# Altium project Blue Tractor_v1.1-2021.PrjPCB (part 3 of 4)

## Sheet [04] - USB-UART.SchDoc
size A4
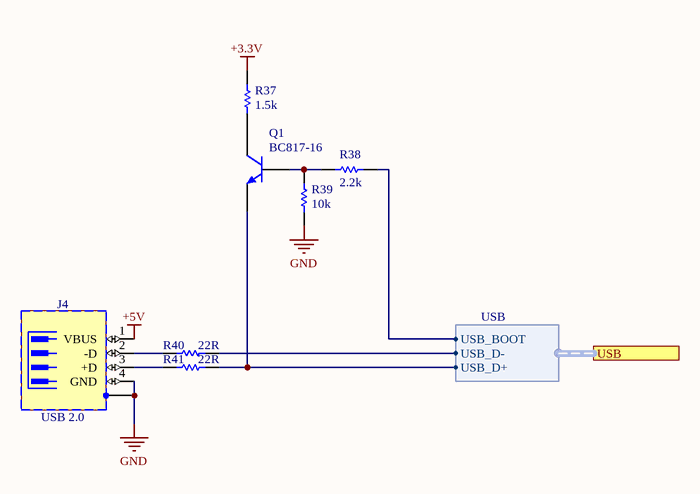
[diagram p5: [04] - USB-UART.SchDoc]

### Parts
J4  USB 2.0  [WURTH_614 104 150 121]
Q1  BC817-16  [SOT23-3]
R37  Resistance: 1.5k  [Res-0603]  (hidden comment: Res1)
R38  Resistance: 2.2k  [Res-0603]  (hidden comment: Res1)
R39  Resistance: 10k  [Res-0603]  (hidden comment: Res1)
R40  Resistance: 22R  [Res-0603]  (hidden comment: Res1)
R41  Resistance: 22R  [Res-0603]  (hidden comment: Res1)

### Ports
USB (harness USB)

### Harnesses
USB: USB_BOOT, USB_D-, USB_D+

### Nets
+3.3V: R37.1
+5V: J4.1(VBUS)
GND: J4.4(GND) J4.5(SHIELD) R39.1
USB_BOOT: R38.2 ; port USB.USB_BOOT
USB_D+: Q1.2(E) R41.1 ; port USB.USB_D+
USB_D–: R40.1 ; port USB.USB_D-
NetJ4_2: J4.2(-D) R40.2
NetJ4_3: J4.3(+D) R41.2
NetQ1_1: Q1.1(B) R38.1 R39.2
NetQ1_3: Q1.3(C) R37.2

### Notes on the sheet
- Title
- Size:
- Date:
- A4
- Number:
- Time:
- Revision:
- Sheet
- of
- File:

### Library data of the parts
J4 = WURTH_614 104 150 121: 4 Pin + 1 Shield USB Receptacle; Part Description: USB 2.0 Type A Receptacle, Right Angle, SLIM Type, 4 Contacts; Manufacturer: WURTH ELEKTRONIK; PressFit: No; Number of Contacts: 4; Part Number: WURTH_614 104 150 121; Component Kind: Standard; Component Type: Standard; Pin Count: 5; Family: USB 2.0; Mounted: Yes; Socket: No; SMD: No; Sense: No; Status: None; Manufacturer Part Number: 614 104 150 121; ComponentHeight: 7.2mm; HelpURL: \\cern.ch\dfs\Applications\Altium\Datasheets\WURTH_614 104 150 121.pdf; Author: CERN DEM JMW; CreateDate: 07.07.2015; LatestRevisionDate: 07.07.2015; Supplier 1: Digi-Key; Supplier Part Number 1: 732-5962-6-ND; Stock 1: 1074; Pricing 1: 1=2.1, 10=1.927, 50=1.784, 100=1.641 (USD); Mount: Through Hole,Horizontal; Contact Material: Copper Alloy; Contact Plating: Gold; Packaging: Tape and Reel; Connector Type: USB; Gender: Receptacle; Orientation: Right Angle; USB Standard: USB 2.0; REACH SVHC: Unknown; ComponentLink1URL: https://www.distrelec.biz/Web/Downloads/40/28/614104150121.pdf?mime=application%2Fpdf; ComponentLink1Description: https://www.distrelec.biz/Web/Downloads/40/28/614104150121.pdf?mime=application%2Fpdf; ComponentLink2URL: http://katalog.we-online.de/em/datasheet/614104150121.pdf; ComponentLink2Description: http://katalog.we-online.de/em/datasheet/614104150121.pdf; ComponentLink3URL: http://www.farnell.com/cad/2130935.pdf; ComponentLink3Description: http://www.farnell.com/cad/2130935.pdf; ComponentLink4URL: http://www.farnell.com/cad/1889803.pdf; ComponentLink4Description: http://www.farnell.com/cad/1889803.pdf
Q1 = BC817-16: NPN General-purpose Transistor; Manufacturer: ON Semiconductor; Manufacturer Part Number: BC817-16LT3G; hFE Min: 100; Max Power Dissipation: 300mW; Collector Emitter Voltage (VCEO): 45V; Max Collector Current: 500mA; Transition Frequency: 100MHz; Collector Base Voltage (VCBO): 50V; Emitter Base Voltage (VEBO): 5V; Collector Emitter Saturation Voltage: 700mV; Element Configuration: Single; Number of Elements: 1; ComponentLink1URL: http://www.mccsemi.com/up_pdf/BC817-16~BC817-40(SOT-23).pdf; ComponentLink1Description: http://www.mccsemi.com/up_pdf/BC817-16~BC817-40(SOT-23).pdf; Supplier 1: Digi-Key; Supplier Part Number 1: BC817-16LT3GOSDKR-ND; Stock 1: 22032; Pricing 1: 1=0.13, 10=0.121, 100=0.0658, 500=0.04048, 1000=0.02759 (USD); Case/Package: SOT-23-3; Number of Pins: 3; Contact Plating: Tin,Matte; Min Operating Temperature: -55°C; Max Operating Temperature: 150°C; Package Quantity: 10000; Packaging: Tape and Reel; Collector Emitter Breakdown Voltage: 45V; Polarity: NPN; Power Dissipation: 300mW; Frequency: 100MHz; Max Breakdown Voltage: 45V; Gain Bandwidth Product: 100MHz; Radiation Hardening: No; Lead Free: Lead Free; Halogen Free: Halogen Free; ComponentLink2URL: https://datasheet.ciiva.com/15139/getdatasheetpartid-84401-15139109.pdf; ComponentLink2Description: https://datasheet.ciiva.com/15139/getdatasheetpartid-84401-15139109.pdf; ComponentLink3URL: https://datasheet.ciiva.com/980/bc817-16lt1-d-980715.pdf; ComponentLink3Description: https://datasheet.ciiva.com/980/bc817-16lt1-d-980715.pdf; ComponentLink4URL: https://datasheet.ciiva.com/26115/bc817-16lt1-d-26115598.pdf; ComponentLink4Description: https://datasheet.ciiva.com/26115/bc817-16lt1-d-26115598.pdf; ComponentLink5URL: https://datasheet.ciiva.com/11204/bc817-16lt1-d-11204335.pdf; ComponentLink5Description: https://datasheet.ciiva.com/11204/bc817-16lt1-d-11204335.pdf
R37 = 1: Chip Resistor; Manufacturer: Panasonic; Manufacturer Part Number: ERJ-3EKF1501V; Power Rating: 100mW; Tolerance: 1%; Voltage Rating: 75V; Temperature Coefficient: 100ppm/°C; Supplier 1: Digi-Key; Supplier Part Number 1: P1.50KHDKR-ND; Stock 1: 965786; Pricing 1: 1=0.1, 10=0.079, 100=0.0323, 1000=0.01449, 2500=0.01258 (USD); Mount: Surface Mount; Case/Package: 0603; Number of Pins: 2; Weight: 7.1E-05oz; Case Code (Metric): 1608; Case Code (Imperial): 0603; Contact Plating: Tin; Min Operating Temperature: -55°C; Max Operating Temperature: 155°C; Packaging: Tape and Reel; Package Quantity: 1; Composition: Thick Film; Number of Terminations: 2; Termination: SMD/SMT; Military Standard: Not; Max Power Dissipation: 100mW; Voltage Rating (DC): 75V; Features: Automotive AEC-Q200; Length: 1.6mm; Height: 0.45mm; Width: 0.031inch; Depth: 0.8mm; Radiation Hardening: No; REACH SVHC: No SVHC; Lead Free: Lead Free; ComponentLink1URL: https://datasheet.ciiva.com/34303/1987644-34303574.pdf; ComponentLink1Description: https://datasheet.ciiva.com/34303/1987644-34303574.pdf; ComponentLink2URL: https://datasheet.ciiva.com/7830/426256-7830981.pdf; ComponentLink2Description: https://datasheet.ciiva.com/7830/426256-7830981.pdf; ComponentLink3URL: https://datasheet.ciiva.com/9198/aoa0000ce2-9198086.pdf; ComponentLink3Description: https://datasheet.ciiva.com/9198/aoa0000ce2-9198086.pdf; ComponentLink4URL: https://datasheet.ciiva.com/48530/aoa0000ce2-48530982.pdf; ComponentLink4Description: https://datasheet.ciiva.com/48530/aoa0000ce2-48530982.pdf; ComponentLink5URL: https://datasheet.ciiva.com/16511/aoa0000ce2-16511927.pdf; ComponentLink5Description: https://datasheet.ciiva.com/16511/aoa0000ce2-16511927.pdf; ComponentLink6URL: https://datasheet.ciiva.com/17214/aoa0000ce2-17214761.pdf; ComponentLink6Description: https://datasheet.ciiva.com/17214/aoa0000ce2-17214761.pdf; ComponentLink7URL: https://datasheet.ciiva.com/28514/1678782-28514202.pdf; ComponentLink7Description: https://datasheet.ciiva.com/28514/1678782-28514202.pdf; ComponentLink8URL: https://datasheet.ciiva.com/7830/aoa0000ce2-7830731.pdf; ComponentLink8Description: https://datasheet.ciiva.com/7830/aoa0000ce2-7830731.pdf; ComponentLink9URL: https://datasheet.ciiva.com/16449/aoa0000ce2-16449406.pdf; ComponentLink9Description: https://datasheet.ciiva.com/16449/aoa0000ce2-16449406.pdf; ComponentLink10URL: https://datasheet.ciiva.com/16767/70260748-16767326.pdf; ComponentLink10Description: https://datasheet.ciiva.com/16767/70260748-16767326.pdf; ComponentLink11URL: https://datasheet.ciiva.com/16759/70260748-16759967.pdf; ComponentLink11Description: https://datasheet.ciiva.com/16759/70260748-16759967.pdf; ComponentLink12URL: https://datasheet.ciiva.com/24124/aoa0000ce2-24124271.pdf; ComponentLink12Description: https://datasheet.ciiva.com/24124/aoa0000ce2-24124271.pdf
R38 = 1: Chip Resistor; Manufacturer: Panasonic; Manufacturer Part Number: ERJ-3GEYJ222V; Power Rating: 100mW; Tolerance: 5%; Voltage Rating: 75V; Temperature Coefficient: 200ppm/°C; Voltage Rating (DC): 50V; Supplier 1: Digi-Key; Supplier Part Number 1: P2.2KGDKR-ND; Stock 1: 1578287; Pricing 1: 1=0.1, 10=0.054, 100=0.022, 1000=0.00988, 2500=0.00858 (USD); Mount: Surface Mount; Case/Package: 0603; Case Code (Imperial): 0603; Case Code (Metric): 1608; Contact Plating: Tin; Min Operating Temperature: -55°C; Max Operating Temperature: 155°C; Package Quantity: 1; Packaging: Tape and Reel; Composition: Thick Film; Number of Terminations: 2; Military Standard: Not; Termination: SMD/SMT; Max Power Dissipation: 100mW; Features: Automotive AEC-Q200; Working Voltage: 75V; Length: 1.6mm; Height: 0.45mm; Width: 0.8mm; Depth: 0.8mm; Radiation Hardening: No; REACH SVHC: No SVHC; Lead Free: Lead Free; ComponentLink1URL: https://datasheet.ciiva.com/11821/0900766b80f806dd-11821453.pdf; ComponentLink1Description: https://datasheet.ciiva.com/11821/0900766b80f806dd-11821453.pdf; ComponentLink2URL: https://datasheet.ciiva.com/34303/1988639-34303614.pdf; ComponentLink2Description: https://datasheet.ciiva.com/34303/1988639-34303614.pdf; ComponentLink3URL: https://datasheet.ciiva.com/16760/70255313-16760341.pdf; ComponentLink3Description: https://datasheet.ciiva.com/16760/70255313-16760341.pdf; ComponentLink4URL: https://datasheet.ciiva.com/9117/aoa0000ce1-9117127.pdf; ComponentLink4Description: https://datasheet.ciiva.com/9117/aoa0000ce1-9117127.pdf; ComponentLink5URL: https://datasheet.ciiva.com/46380/1500035-46380411.pdf; ComponentLink5Description: https://datasheet.ciiva.com/46380/1500035-46380411.pdf; ComponentLink6URL: https://datasheet.ciiva.com/16765/70255313-16765244.pdf; ComponentLink6Description: https://datasheet.ciiva.com/16765/70255313-16765244.pdf; ComponentLink7URL: https://datasheet.ciiva.com/16199/aoa0000ce1-16199902.pdf; ComponentLink7Description: https://datasheet.ciiva.com/16199/aoa0000ce1-16199902.pdf; ComponentLink8URL: https://datasheet.ciiva.com/16853/aoa0000ce1-16853407.pdf; ComponentLink8Description: https://datasheet.ciiva.com/16853/aoa0000ce1-16853407.pdf; ComponentLink9URL: https://datasheet.ciiva.com/22758/1500035-22758223.pdf; ComponentLink9Description: https://datasheet.ciiva.com/22758/1500035-22758223.pdf; ComponentLink10URL: https://datasheet.ciiva.com/28584/1678796-28584095.pdf; ComponentLink10Description: https://datasheet.ciiva.com/28584/1678796-28584095.pdf
R39 = 1: Chip Resistor; Manufacturer: Panasonic; Manufacturer Part Number: ERJ-3GEYJ103V; Tolerance: 5%; Power Rating: 100mW; Voltage Rating: 75V; Temperature Coefficient: 200ppm/°C; Voltage Rating (DC): 50V; Supplier 1: Digi-Key; Supplier Part Number 1: P10KGDKR-ND; Stock 1: 10740434; Pricing 1: 1=0.1, 10=0.054, 100=0.022, 1000=0.00988, 2500=0.00858 (USD); Mount: Surface Mount; Case/Package: 0603; Weight: 7.1E-05oz; Case Code (Imperial): 0603; Case Code (Metric): 1608; Contact Plating: Tin; Min Operating Temperature: -55°C; Max Operating Temperature: 155°C; Packaging: Tape and Reel; Package Quantity: 1; Composition: Thick Film; Termination: SMD/SMT; Number of Terminations: 2; Military Standard: Not; Max Power Dissipation: 100mW; Working Voltage: 75V; Features: Automotive AEC-Q200; Length: 1.6mm; Height: 0.45mm; Width: 0.8mm; Depth: 0.8mm; REACH SVHC: No SVHC; Lead Free: Lead Free; ComponentLink1URL: https://datasheet.ciiva.com/34303/2007265-34303757.pdf; ComponentLink1Description: https://datasheet.ciiva.com/34303/2007265-34303757.pdf; ComponentLink2URL: https://datasheet.ciiva.com/11809/0900766b80f806dd-11809566.pdf; ComponentLink2Description: https://datasheet.ciiva.com/11809/0900766b80f806dd-11809566.pdf; ComponentLink3URL: https://datasheet.ciiva.com/28514/1678796-28514213.pdf; ComponentLink3Description: https://datasheet.ciiva.com/28514/1678796-28514213.pdf; ComponentLink4URL: https://datasheet.ciiva.com/30147/4aoa0000ce1-30147029.pdf; ComponentLink4Description: https://datasheet.ciiva.com/30147/4aoa0000ce1-30147029.pdf; ComponentLink5URL: https://datasheet.ciiva.com/46371/1678796-46371909.pdf; ComponentLink5Description: https://datasheet.ciiva.com/46371/1678796-46371909.pdf; ComponentLink6URL: https://datasheet.ciiva.com/24133/aoa0000ce1-37422-24133064.pdf; ComponentLink6Description: https://datasheet.ciiva.com/24133/aoa0000ce1-37422-24133064.pdf; ComponentLink7URL: https://datasheet.ciiva.com/46385/1678796-46385240.pdf; ComponentLink7Description: https://datasheet.ciiva.com/46385/1678796-46385240.pdf; ComponentLink8URL: https://datasheet.ciiva.com/17212/aoa0000ce1-17212106.pdf; ComponentLink8Description: https://datasheet.ciiva.com/17212/aoa0000ce1-17212106.pdf; ComponentLink9URL: https://datasheet.ciiva.com/9117/aoa0000ce1-9117038.pdf; ComponentLink9Description: https://datasheet.ciiva.com/9117/aoa0000ce1-9117038.pdf; ComponentLink10URL: https://datasheet.ciiva.com/16740/aoa0000ce1-16740655.pdf; ComponentLink10Description: https://datasheet.ciiva.com/16740/aoa0000ce1-16740655.pdf; ComponentLink11URL: https://datasheet.ciiva.com/48531/aoa0000ce1-48531887.pdf; ComponentLink11Description: https://datasheet.ciiva.com/48531/aoa0000ce1-48531887.pdf
R40 R41 = 1: Chip Resistor; Manufacturer: Panasonic; Manufacturer Part Number: ERJ-3GEYJ220V; Power Rating: 100mW; Tolerance: 5%; Voltage Rating: 75V; Temperature Coefficient: 200ppm/°C; Voltage Rating (DC): 50V; Supplier 1: Digi-Key; Supplier Part Number 1: P22GDKR-ND; Stock 1: 938288; Pricing 1: 1=0.1, 10=0.054, 100=0.022, 1000=0.00988, 2500=0.00858 (USD); Mount: Surface Mount; Case/Package: 0603; Case Code (Metric): 1608; Case Code (Imperial): 0603; Contact Plating: Tin; Min Operating Temperature: -55°C; Max Operating Temperature: 155°C; Packaging: Tape and Reel; Package Quantity: 1; Composition: Thick Film; Number of Terminations: 2; Termination: SMD/SMT; Military Standard: Not; Max Power Dissipation: 100mW; Features: Automotive AEC-Q200; Length: 1.6mm; Height: 0.45mm; Width: 0.031inch; Depth: 0.8mm; Radiation Hardening: No; REACH SVHC: No SVHC; Lead Free: Lead Free; ComponentLink1URL: https://datasheet.ciiva.com/11821/0900766b80f806dd-11821421.pdf; ComponentLink1Description: https://datasheet.ciiva.com/11821/0900766b80f806dd-11821421.pdf; ComponentLink2URL: https://datasheet.ciiva.com/16775/70255313-16775287.pdf; ComponentLink2Description: https://datasheet.ciiva.com/16775/70255313-16775287.pdf; ComponentLink3URL: https://datasheet.ciiva.com/17210/aoa0000ce1-17210855.pdf; ComponentLink3Description: https://datasheet.ciiva.com/17210/aoa0000ce1-17210855.pdf; ComponentLink4URL: https://datasheet.ciiva.com/24071/aoa0000ce1-37422-24071191.pdf; ComponentLink4Description: https://datasheet.ciiva.com/24071/aoa0000ce1-37422-24071191.pdf; ComponentLink5URL: https://datasheet.ciiva.com/28546/1678796-28546119.pdf; ComponentLink5Description: https://datasheet.ciiva.com/28546/1678796-28546119.pdf; ComponentLink6URL: https://datasheet.ciiva.com/48531/aoa0000ce1-48531767.pdf; ComponentLink6Description: https://datasheet.ciiva.com/48531/aoa0000ce1-48531767.pdf; ComponentLink7URL: https://datasheet.ciiva.com/28686/1678796-28686939.pdf; ComponentLink7Description: https://datasheet.ciiva.com/28686/1678796-28686939.pdf; ComponentLink8URL: https://datasheet.ciiva.com/5868/1500035-5868156.pdf; ComponentLink8Description: https://datasheet.ciiva.com/5868/1500035-5868156.pdf; ComponentLink9URL: https://datasheet.ciiva.com/9117/aoa0000ce1-9117118.pdf; ComponentLink9Description: https://datasheet.ciiva.com/9117/aoa0000ce1-9117118.pdf; ComponentLink10URL: https://datasheet.ciiva.com/16517/aoa0000ce1-16517054.pdf; ComponentLink10Description: https://datasheet.ciiva.com/16517/aoa0000ce1-16517054.pdf

## Sheet [08] -LoRa_RAK3172.SchDoc
size A4
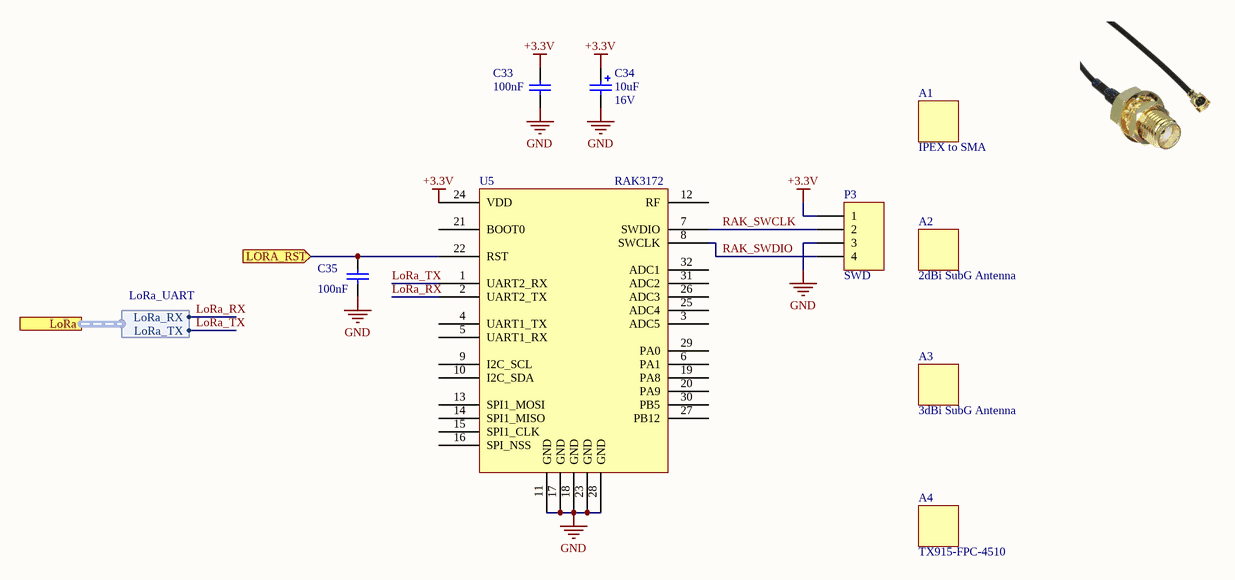
[diagram p6: [08] -LoRa_RAK3172.SchDoc]

### Parts
A1  IPEX to SMA  (mechanical)
A2  2dBi SubG Antenna  (mechanical)
A3  3dBi SubG Antenna  (mechanical)
A4  TX915-FPC-4510  (mechanical)
C33  Capacitance: 100nF  [Cap 0603]  (hidden comment: Capacitor)
C34  Capacitance: 10uF  Voltage Rating: 16V  [Tantalum 3216 A]  (hidden comment: Capacitor Polarized)
C35  Capacitance: 100nF  [Cap 0603]  (hidden comment: Capacitor)
P3  SWD  [HEADER SMD]
U5  RAK3172  [RAK3172]

### Ports
LoRa (harness LoRa_UART), LORA_RST (in)

### Harnesses
LoRa_UART: LoRa_RX, LoRa_TX

### Nets
+3.3V: C33.2 C34.1 P3.1 U5.24(VDD)
GND: C33.1 C34.2 C35.1 P3.3 U5.11(GND) U5.17(GND) U5.18(GND) U5.23(GND) U5.28(GND)
LoRa_RX: U5.2(UART2_TX) ; port LoRa.LoRa_RX
LoRa_TX: U5.1(UART2_RX) ; port LoRa.LoRa_TX
RAK_SWCLK: P3.2 U5.7(SWDIO)
RAK_SWDIO: P3.4 U5.8(SWCLK)
NetC35_2: C35.2 U5.22(RST) ; port LORA_RST

Not connected (* = marked no-connect by the designer): U5 3(ADC5) 4(UART1_TX) 5(UART1_RX) 6(PA1) 9(I2C_SCL) 10(I2C_SDA) 12(RF) 13(SPI1_MOSI) 14(SPI1_MISO) 15(SPI1_CLK) 16(SPI_NSS) 19(PA8) 20(PA9) 21(BOOT0) 25(ADC4) 26(ADC3) 27(PB12) 29(PA0) 30(PB5) 31(ADC2) 32(ADC1)

### Notes on the sheet
- Title
- Size:
- Date:
- A4
- Number:
- Time:
- Revision:
- Sheet
- of
- File:

### Library data of the parts
A1 = Mechanical_component: IPEX to SMA adapter cable; Manufacturer 1: Adam Equipment; Manufacturer Part Number 1: CA-DKCA0-305L0-AJI0-O; Supplier 1: Digi-Key; Supplier Part Number 1: 2057-CA-DKCA0-305L0-AJI0-O-ND; RoHS: No
A2 = Mechanical_component: Manufacturer 1: 5; Manufacturer Part Number 1: 2dBi SubG Antenna; Supplier Unit Price 1: *
A3 = Mechanical_component: Manufacturer 1: RAK; Manufacturer Part Number 1: 3dBi SubG Antenna; Supplier Unit Price 1: 7
A4 = Mechanical_component: TX915-FPC-4510 868~930MHz adhesive antenna; Manufacturer 1: EBYTE; Manufacturer Part Number 1: TX915-FPC-4510; Supplier Unit Price 1: 0,28
C33 C35 = 1: Cap Ceramic 0.1uF 50VDC X7R 10% SMD 0603 Paper T/R; Manufacturer: Samsung; Manufacturer Part Number: CL10B104KB8NNNC; Voltage Rating: 50V; ComponentLink1URL: http://www.kemet.com/docfinder?Partnumber=C0603C104K5RACTU; ComponentLink1Description: http://www.kemet.com/docfinder?Partnumber=C0603C104K5RACTU; ComponentLink2URL: https://datasheet.ciiva.com/25803/cl10b104kb8nnnc-25803393.pdf?src-supplier=Digi-Key; ComponentLink2Description: https://datasheet.ciiva.com/25803/cl10b104kb8nnnc-25803393.pdf?src-supplier=Digi-Key; ComponentLink3URL: https://datasheet.ciiva.com/26838/getdatasheetpartid-89097-26838411.pdf?src-supplier=Verical; ComponentLink3Description: https://datasheet.ciiva.com/26838/getdatasheetpartid-89097-26838411.pdf?src-supplier=Verical; ComponentLink4URL: https://datasheet.ciiva.com/29198/456651-da-01-en-vs-kondensator-0605-29198839.pdf?src-supplier=Conrad; ComponentLink4Description: https://datasheet.ciiva.com/29198/456651-da-01-en-vs-kondensator-0605-29198839.pdf?src-supplier=Conrad; Supplier 1: Digi-Key; Supplier Part Number 1: 1276-1000-1-ND; RoHS: Yes; Category: Ceramic Capacitors; Stock 1: 17279119; Pricing 1: 1=0,10000, 10=0,03200, 50=0,01720, 100=0,01410, 500=0,01008, 1000=0,00793 (USD); Mount: Surface Mount; Case/Package: 0603; Case Code (Metric): 1608; Case Code (Imperial): 0603; Material: Ceramic; Contact Plating: Tin; Min Operating Temperature: -55°C; Max Operating Temperature: 125°C; Tolerance: 10%; Package Quantity: 1; Packaging: Tape and Reel; Dielectric: X7R; Voltage: 50V; Voltage Rating (DC): 50V; Length: 1.6mm; Height: 0.8mm; Width: 0.031inch; Depth: 0.8mm; Thickness: 0.035inch; Radiation Hardening: No; Lead Free: Lead Free
C34 = 2: CAP TANT 10UF 10% 16V 1206; Manufacturer: Vishay Sprague; Manufacturer Part Number: 293D106X9016A2TE3; Dielectric Material: Tantalum; ESR (Equivalent Series Resistance): 3R; Ripple Current: 160mA; Leakage Current: 1.6uA; Polarity: Polar; Dissipation Factor: 6%; Q Factor: 6; Supplier 1: Digi-Key; Supplier Part Number 1: 718-1123-1-ND; RoHS: Yes; Category: Tantalum Capacitors; Stock 1: 76138; Pricing 1: 1=0,54000, 10=0,38000, 50=0,28720, 100=0,25010, 500=0,18524, 1000=0,15745 (USD); Mount: Surface Mount,PCB; Case/Package: 1206; Case Code (Imperial): 1206; Case Code (Metric): 3216; Min Operating Temperature: -55°C; Max Operating Temperature: 125°C; Tolerance: 10%; Packaging: Tape and Reel; Package Quantity: 1; Voltage Rating (DC): 16V; Termination: SMD/SMT; Voltage: 16V; Features: General Purpose; Series: TANTAMOUNT® 293D; Length: 3.2mm; Width: 1.6mm; Height: 1.6mm; Height - Seated (Max): 0.071inch; Depth: 1.6mm; Radiation Hardening: No; REACH SVHC: Unknown; Lead Free: Lead Free; RoHS Compliant: Yes; ComponentLink1URL: https://datasheet.ciiva.com/11793/0900766b80d97b37-11793412.pdf?src-supplier=RSComponents; ComponentLink1Description: https://datasheet.ciiva.com/11793/0900766b80d97b37-11793412.pdf?src-supplier=RSComponents; ComponentLink2URL: https://datasheet.ciiva.com/257/293d-257982.pdf?src-supplier=Digi-Key; ComponentLink2Description: https://datasheet.ciiva.com/257/293d-257982.pdf?src-supplier=Digi-Key; ComponentLink3URL: https://datasheet.ciiva.com/257/293d-257983.pdf?src-supplier=Digi-Key; ComponentLink3Description: https://datasheet.ciiva.com/257/293d-257983.pdf?src-supplier=Digi-Key; ComponentLink4URL: https://datasheet.ciiva.com/1463/293d-1463155.pdf?src-supplier=Element14; ComponentLink4Description: https://datasheet.ciiva.com/1463/293d-1463155.pdf?src-supplier=Element14; ComponentLink5URL: https://datasheet.ciiva.com/3003/293d-3003829.pdf?src-supplier=Avnet; ComponentLink5Description: https://datasheet.ciiva.com/3003/293d-3003829.pdf?src-supplier=Avnet; ComponentLink6URL: https://datasheet.ciiva.com/16308/293d-16308277.pdf?src-supplier=Future+Electronics; ComponentLink6Description: https://datasheet.ciiva.com/16308/293d-16308277.pdf?src-supplier=Future+Electronics; ComponentLink7URL: https://datasheet.ciiva.com/22695/1910915-22695111.pdf?src-supplier=Element14; ComponentLink7Description: https://datasheet.ciiva.com/22695/1910915-22695111.pdf?src-supplier=Element14; ComponentLink8URL: https://datasheet.ciiva.com/257/293d-257981.pdf?src-supplier=Digi-Key; ComponentLink8Description: https://datasheet.ciiva.com/257/293d-257981.pdf?src-supplier=Digi-Key
P3 = 5: CONN HEADER VERT 4POS 2.54MM; Manufacturer: Wurth Electronics; Manufacturer Part Number: 61300411121; Connector Type: Male Pin; Number of Positions: 4; Gender: Male; Pitch: 0.1inch; Supplier 1: Digi-Key; Supplier Part Number 1: 732-5317-ND; RoHS: Yes; Category: Connectors; Stock 1: 52329; Pricing 1: 1=0,18000, 10=0,15300, 25=0,12720, 50=0,10600, 100=0,09600, 1000=0,08800 (USD); Mount: Through Hole; Color: Black; Contact Plating: Gold; Contact Material: Copper; Packaging: Bulk; Termination: Solder; Number of Contacts: 4; Number of Rows: 1; Contact Mating Length: 0.236inch; REACH SVHC: Unknown; Lead Free: Lead Free; ComponentLink1URL: http://www.farnell.com/cad/1737268.pdf?src-supplier=Element14; ComponentLink1Description: http://www.farnell.com/cad/1737268.pdf?src-supplier=Element14; ComponentLink2URL: https://katalog.we-online.de/em/datasheet/6130xx11121.pdf?src-supplier=Digi-Key; ComponentLink2Description: https://katalog.we-online.de/em/datasheet/6130xx11121.pdf?src-supplier=Digi-Key
U5 = RAK3172: LPWAN Module; Manufacturer 1: RAK; Manufacturer Part Number 1: RAK3172; Supplier 1: RAK; Supplier Part Number 1: RAK3172; Pricing 1: 1=5,99; Mount: Surface Mount; Supplier Unit Price 1: 5,99

## Sheet [03] - WiFi.SchDoc
size A4
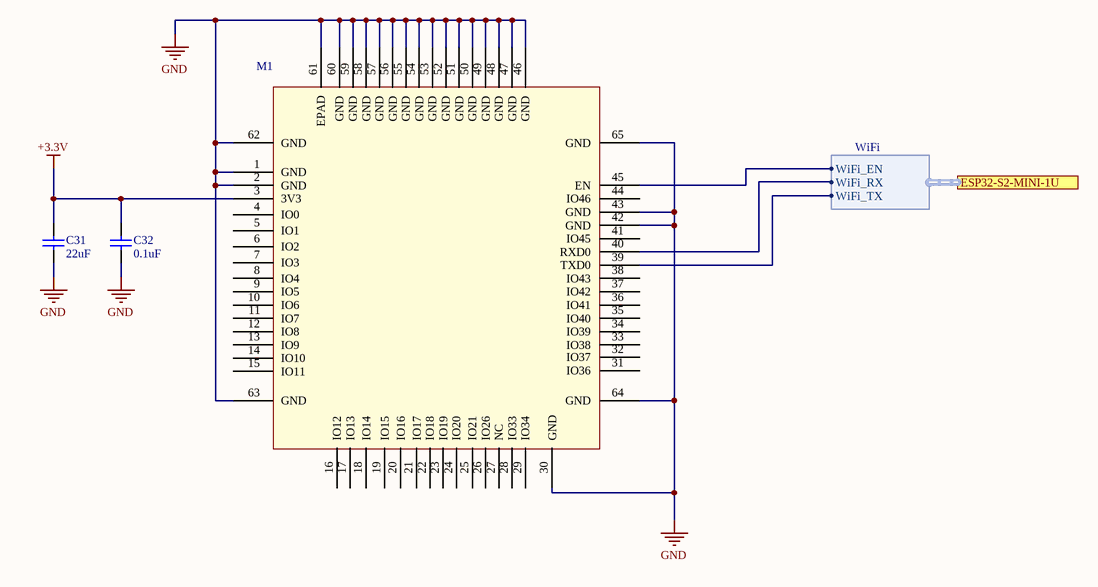
[diagram p7: [03] - WiFi.SchDoc]

### Parts
C31  value 22uF  [SMD(0805)]  (hidden comment: Cap)
C32  value 0.1uF  [SMD(0805)]  (hidden comment: Cap)
M1  ESP32-S2-MINI-1U _Module  (value not drawn)

### Ports
ESP32-S2-MINI-1U (harness WiFi)

### Harnesses
WiFi: WiFi_EN, WiFi_RX, WiFi_TX

### Nets
+3.3V: C31.2 C32.2 M1.3(3V3)
GND: C31.1 C32.1 M1.1(GND) M1.2(GND) M1.30(GND) M1.42(GND) M1.43(GND) M1.46(GND) M1.47(GND) M1.48(GND) M1.49(GND) M1.50(GND) M1.51(GND) M1.52(GND) M1.53(GND) M1.54(GND) M1.55(GND) M1.56(GND) M1.57(GND) M1.58(GND) M1.59(GND) M1.60(GND) M1.61(EPAD) M1.62(GND) M1.63(GND) M1.64(GND) M1.65(GND)
WiFi_EN: M1.45(EN) ; port ESP32-S2-MINI-1U.WiFi_EN
WiFi_RX: M1.40(RXD0) ; port ESP32-S2-MINI-1U.WiFi_RX
WiFi_TX: M1.39(TXD0) ; port ESP32-S2-MINI-1U.WiFi_TX

Not connected (* = marked no-connect by the designer): M1 4(IO0) 5(IO1) 6(IO2) 7(IO3) 8(IO4) 9(IO5) 10(IO6) 11(IO7) 12(IO8) 13(IO9) 14(IO10) 15(IO11) 16(IO12) 17(IO13) 18(IO14) 19(IO15) 20(IO16) 21(IO17) 22(IO18) 23(IO19) 24(IO20) 25(IO21) 26(IO26) 27(NC) 28(IO33) 29(IO34) 31(IO36) 32(IO37) 33(IO38) 34(IO39) 35(IO40) 36(IO41) 37(IO42) 38(IO43) 41(IO45) 44(IO46)

### Notes on the sheet
- Title
- Size:
- Date:
- A4
- Number:
- Time:
- Revision:
- Sheet
- of
- File:

### Library data of the parts
C31 C32 = Cap: Capacitor
M1 = ESP32-S2-MINI-1U _Module: Esp-32-S2-MINI-1U; Datasheet: https://www.espressif.com/en/support/download/documents

## Sheet [07] - SD.SchDoc
size A4
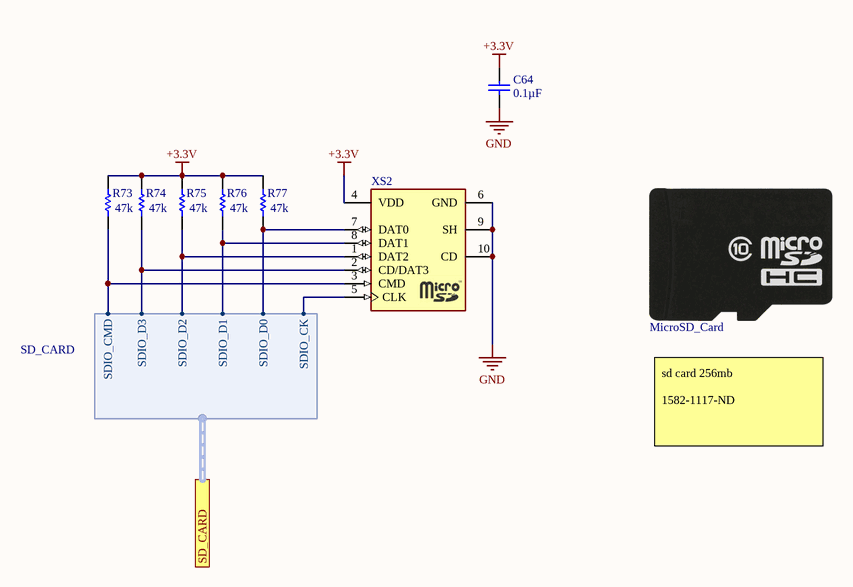
[diagram p8: [07] - SD.SchDoc]

### Parts
*1  MicroSD_Card  (mechanical)
C64  Capacitance: 0.1µF  [Cap 0603]  (hidden comment: Capacitor)
R73  Resistance: 47k  [Res-0603]  (hidden comment: Res1)
R74  Resistance: 47k  [Res-0603]  (hidden comment: Res1)
R75  Resistance: 47k  [Res-0603]  (hidden comment: Res1)
R76  Resistance: 47k  [Res-0603]  (hidden comment: Res1)
R77  Resistance: 47k  [Res-0603]  (hidden comment: Res1)
XS2  (no value)  [MICROSD]

### Ports
SD_CARD (harness SD_CARD)

### Harnesses
SD_CARD: SDIO_CMD, SDIO_D0, SDIO_D1, SDIO_D2, SDIO_D3, SDIO_CK

### Nets
+3.3V: C64.2 R73.2 R74.2 R75.2 R76.2 R77.2 XS2.4(VDD)
GND: C64.1 XS2.6(GND) XS2.9(SH) XS2.10(CD)
SDIO_CK: XS2.5(CLK) ; port SD_CARD.SDIO_CK
SDIO_CMD: R73.1 XS2.3(CMD) ; port SD_CARD.SDIO_CMD
SDIO_D0: R77.1 XS2.7(DAT0) ; port SD_CARD.SDIO_D0
SDIO_D1: R76.1 XS2.8(DAT1) ; port SD_CARD.SDIO_D1
SDIO_D2: R75.1 XS2.1(DAT2) ; port SD_CARD.SDIO_D2
SDIO_D3: R74.1 XS2.2(CD/DAT3) ; port SD_CARD.SDIO_D3

### Notes on the sheet
- sd card 256mb
  1582-1117-ND
- Title
- Size:
- Date:
- A4
- Number:
- Time:
- Revision:
- Sheet
- of
- File:

### Library data of the parts
*1 = MicroSD_Card: Manufacturer: Apacer; Manufacturer Part Number: AP-MSD256ISI-1T; Supplier 1: Digi-Key; Supplier Part Number 1: 1582-1117-ND; Stock 1: 4143; Pricing 1: 1=12.85, 10=11.903, 25=11.6336, 50=11.5698, 100=10.1856, 250=9.68168, 500=9.5823, 1000=9.26289 (USD); ComponentLink1URL: http://www.mouser.com/ds/2/24/EDM_mSD(SLC)-957981.pdf; ComponentLink1Description: http://www.mouser.com/ds/2/24/EDM_mSD(SLC)-957981.pdf; ComponentLink2URL: http://eflash.apacerus.com/spec/Card/microSD/Consumer/EDM_mSD(SLC).pdf; ComponentLink2Description: http://eflash.apacerus.com/spec/Card/microSD/Consumer/EDM_mSD(SLC).pdf
C64 = 1: Chip Capacitor Nonpolar; Manufacturer: Kemet; Manufacturer Part Number: C0603C104K5RACTU; Tolerance: ±10%; Voltage - Rated: 50V; Temperature Coefficient: X7R; Supplier 1: Digi-Key; Supplier Part Number 1: 399-5089-1-ND; RoHS: RoHS Compliant; Category: Capacitors; Stock 1: 3992655; Pricing 1: 1=0.1, 10=0.041, 50=0.0222, 100=0.0187, 250=0.01532, 500=0.0131, 1000=0.0102 (USD); Packaging: Cut Tape (CT); Mounting Type: Surface Mount, MLCC; Operating Temperature: -55°C ~ 125°C; Applications: General Purpose; Ratings: -; Package / Case: 0603 (1608 Metric); Size / Dimension: 0.063" L x 0.031" W (1.60mm x 0.80mm); Height - Seated (Max): -; Thickness (Max): 0.034" (0.87mm); Lead Spacing: -; Features: -; Lead Style: -; ComponentLink1URL: http://www.kemet.com/docfinder?Partnumber=C0603C104K5RACTU; ComponentLink1Description: http://www.kemet.com/docfinder?Partnumber=C0603C104K5RACTU
R73-R77 = 1: Chip Resistor; Manufacturer: Panasonic; Manufacturer Part Number: ERJ-3EKF4702V; Tolerance: 1%; Power Rating: 100mW; Voltage Rating: 75V; Temperature Coefficient: 100ppm/°C; Working Voltage: 6V; Supplier 1: Digi-Key; Supplier Part Number 1: P47.0KHDKR-ND; Stock 1: 2918345; Pricing 1: 1=0.1, 10=0.079, 100=0.0323, 1000=0.01449, 2500=0.01258 (USD); Mount: Surface Mount; Case/Package: 0603; Number of Pins: 2; Case Code (Metric): 1608; Case Code (Imperial): 0603; Contact Plating: Tin; Min Operating Temperature: -55°C; Max Operating Temperature: 155°C; Packaging: Tape and Reel; Package Quantity: 1; Composition: Thick Film; Number of Terminations: 2; Termination: SMD/SMT; Military Standard: Not; Max Power Dissipation: 100mW; Voltage Rating (DC): 75V; Features: Automotive AEC-Q200; Length: 1.6mm; Height: 0.022inch; Width: 0.031inch; Depth: 0.8mm; Radiation Hardening: No; REACH SVHC: No SVHC; Lead Free: Lead Free; ComponentLink1URL: https://datasheet.ciiva.com/6138/aoa0000ce2-6138149.pdf; ComponentLink1Description: https://datasheet.ciiva.com/6138/aoa0000ce2-6138149.pdf; ComponentLink2URL: https://datasheet.ciiva.com/48531/aoa0000ce2-48531029.pdf; ComponentLink2Description: https://datasheet.ciiva.com/48531/aoa0000ce2-48531029.pdf; ComponentLink3URL: https://datasheet.ciiva.com/7802/aoa0000ce2-7802421.pdf; ComponentLink3Description: https://datasheet.ciiva.com/7802/aoa0000ce2-7802421.pdf; ComponentLink4URL: https://datasheet.ciiva.com/16514/aoa0000ce2-16514071.pdf; ComponentLink4Description: https://datasheet.ciiva.com/16514/aoa0000ce2-16514071.pdf; ComponentLink5URL: https://datasheet.ciiva.com/46398/1678782-46398088.pdf; ComponentLink5Description: https://datasheet.ciiva.com/46398/1678782-46398088.pdf; ComponentLink6URL: https://datasheet.ciiva.com/24069/aoa0000ce2-24069209.pdf; ComponentLink6Description: https://datasheet.ciiva.com/24069/aoa0000ce2-24069209.pdf; ComponentLink7URL: https://datasheet.ciiva.com/46398/1678782-46398089.pdf; ComponentLink7Description: https://datasheet.ciiva.com/46398/1678782-46398089.pdf; ComponentLink8URL: https://datasheet.ciiva.com/30236/aoa0000ce2-30236698.pdf; ComponentLink8Description: https://datasheet.ciiva.com/30236/aoa0000ce2-30236698.pdf; ComponentLink9URL: https://datasheet.ciiva.com/22722/426256-22722781.pdf; ComponentLink9Description: https://datasheet.ciiva.com/22722/426256-22722781.pdf; ComponentLink10URL: https://datasheet.ciiva.com/7802/1678782-7802686.pdf; ComponentLink10Description: https://datasheet.ciiva.com/7802/1678782-7802686.pdf; ComponentLink11URL: https://datasheet.ciiva.com/16758/70260748-16758831.pdf; ComponentLink11Description: https://datasheet.ciiva.com/16758/70260748-16758831.pdf
XS2 = MICROSD: =Description; Manufacturer: Molex; Manufacturer Part Number: 105162-0001; Connector Type: Connector; Max Voltage Rating (DC): 5V; Number of Contacts: 8; Pitch: 1.09mm; Supplier 1: Digi-Key; Supplier Part Number 1: WM14405DKR-ND; Stock 1: 9741; Pricing 1: 1=0.88, 10=0.774, 100=0.6677, 500=0.54628, 1000=0.48558 (USD); Mount: Surface Mount; Contact Material: Bronze; Contact Plating: Gold; Housing Material: Thermoplastic; Min Operating Temperature: -40°C; Max Operating Temperature: 85°C; Packaging: Tape and Reel; Number of Rows: 1; Package Quantity: 6000; Termination: Solder; Orientation: Right Angle; Number of Circuits: 8; Length: 11.3mm; Depth: 7.6mm; Radiation Hardening: No; ComponentLink1URL: https://datasheet.ciiva.com/29723/1051620101-sd-29723393.pdf; ComponentLink1Description: https://datasheet.ciiva.com/29723/1051620101-sd-29723393.pdf

## Sheet [02] - GSM.SchDoc
size A4
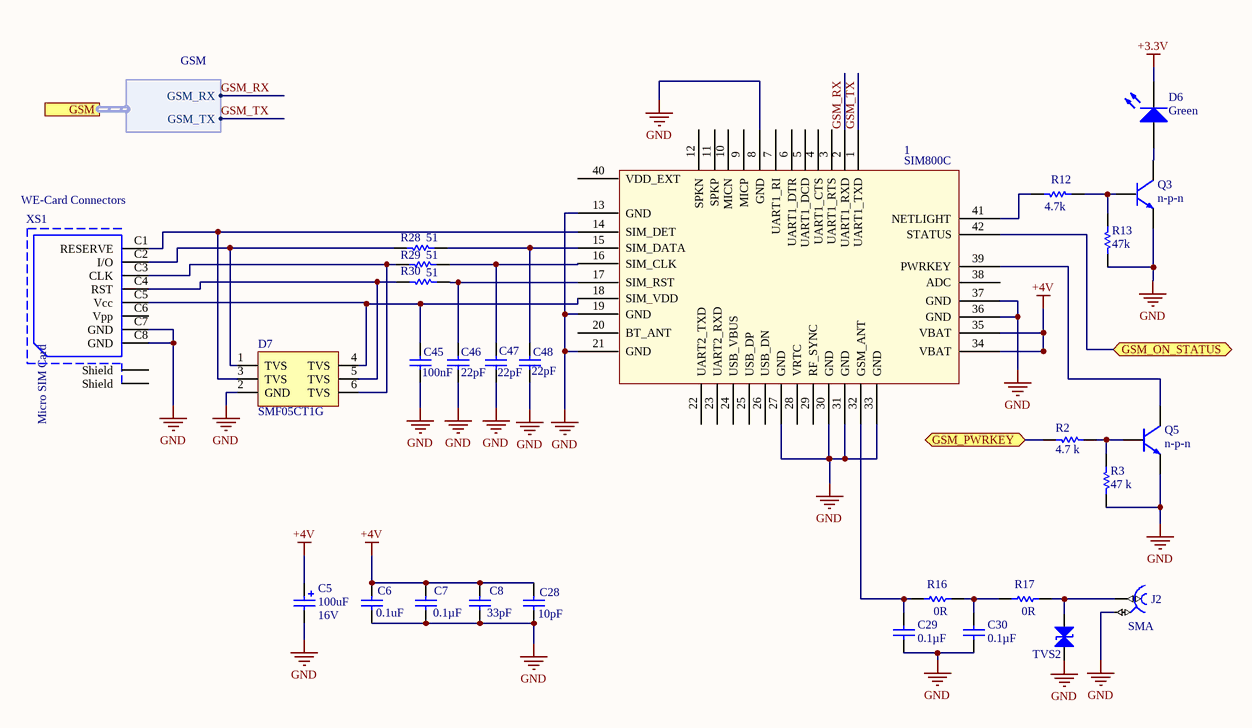
[diagram p9: [02] - GSM.SchDoc]

### Parts
1  SIM800C
C5  Capacitance: 100uF  Voltage - Rated: 16V  [Tantalum 3216 A]  (hidden comment: Capacitor Polarized)
C6  Capacitance: 0.1uF  [Cap 0603]  (hidden comment: Capacitor)
C7  Capacitance: 0.1µF  [Cap 0603]  (hidden comment: Capacitor)
C8  Capacitance: 33pF  [Cap 0603]  (hidden comment: Capacitor)
C28  Capacitance: 10pF  [Cap 0603]  (hidden comment: Capacitor)
C29  Capacitance: 0.1µF  [Cap 0603]  (hidden comment: Capacitor)
C30  Capacitance: 0.1µF  [Cap 0603]  (hidden comment: Capacitor)
C45  Capacitance: 100nF  [Cap 0603]  (hidden comment: Capacitor)
C46  Capacitance: 22pF  [Cap 0603]  (hidden comment: Capacitor)
C47  Capacitance: 22pF  [Cap 0603]  (hidden comment: Capacitor)
C48  Capacitance: 22pF  [Cap 0603]  (hidden comment: Capacitor)
D6  Colour: Green  [Led 0805 green]  (hidden comment: LED)
D7  SMF05CT1G  [TSSOP6]
J2  SMA  [AMPHENOL_132134]
Q3  n-p-n
Q5  n-p-n
R2  Resistance: 4.7 k  [Res-0603]  (hidden comment: Res1)
R3  Resistance: 47 k  [Res-0603]  (hidden comment: Res1)
R12  Resistance: 4.7k  [Res-0603]  (hidden comment: Res1)
R13  Resistance: 47k  [Res-0603]  (hidden comment: Res1)
R16  Resistance: 0R  [Res-0603]  (hidden comment: Res1)
R17  Resistance: 0R  [Res-0603]  (hidden comment: Res1)
R28  Resistance: 51  [Res-0603]  (hidden comment: Res1)
R29  Resistance: 51  [Res-0603]  (hidden comment: Res1)
R30  Resistance: 51  [Res-0603]  (hidden comment: Res1)
TVS2  LXE15AAA1-153  (value not drawn)
XS1  WE-Card Connectors  [693022010811]

### Ports
GSM (harness GSM), GSM_ON_STATUS, GSM_PWRKEY

### Harnesses
GSM: GSM_RX, GSM_TX

### Nets
+3.3V: D6.2(K)
+4V: 1.34(VBAT) 1.35(VBAT) C5.1 C6.2 C7.2 C8.2 C28.2
GND: 1.8(GND) 1.13(GND) 1.19(GND) 1.21(GND) 1.27(GND) 1.30(GND) 1.31(GND) 1.33(GND) 1.36(GND) 1.37(GND) C5.2 C6.1 C7.1 C8.1 C28.1 C29.1 C30.1 C45.1 C46.1 C47.1 C48.1 D7.2(GND) J2.2 Q3.17 Q5.17 R3.1 R13.1 TVS2.16 XS1.C7(GND) XS1.C8(GND)
GSM_RX: 1.2(UART1_RXD) ; port GSM.GSM_RX
GSM_TX: 1.1(UART1_TXD) ; port GSM.GSM_TX
Net1_14: 1.14(SIM_DET) D7.3(TVS) XS1.C1(RESERVE)
Net1_15: 1.15(SIM_DATA) C48.2 R28.1
Net1_16: 1.16(SIM_CLK) C47.2 R29.1
Net1_17: 1.17(SIM_RST) C46.2 R30.1
Net1_18: 1.18(SIM_VDD) C45.2 D7.4(TVS) XS1.C5(Vcc)
Net1_32: 1.32(GSM_ANT) C29.2 R16.2
Net1_39: 1.39(PWRKEY) Q5.16
Net1_41: 1.41(NETLIGHT) R12.1
Net1_42: 1.42(STATUS) ; port GSM_ON_STATUS
NetC30_2: C30.2 R16.1 R17.2
NetD6_1: D6.1(A) Q3.16
NetD7_1: D7.1(TVS) R28.2 XS1.C2(I/O)
NetD7_5: D7.5(TVS) R30.2 XS1.C4(RST)
NetD7_6: D7.6(TVS) R29.2 XS1.C3(CLK)
NetJ2_1: J2.1 R17.1 TVS2.16
NetQ3_15: Q3.15(PG) R12.2 R13.2
NetQ5_15: Q5.15(PG) R2.1 R3.2
NetR2_2: R2.2 ; port GSM_PWRKEY

Not connected (* = marked no-connect by the designer): 1 3(UART1_RTS) 4(UART1_CTS) 5(UART1_DCD) 6(UART1_DTR) 7(UART1_RI) 9(MICP) 10(MICN) 11(SPKP) 12(SPKN) 20(BT_ANT) 22(UART2_TXD) 23(UART2_RXD) 24(USB_VBUS) 25(USB_DP) 26(USB_DN) 28(VRTC) 29(RF_SYNC) 38(ADC) 40(VDD_EXT); XS1 C6(Vpp) Z1(Shield) Z2(Shield)

### Notes on the sheet
- Title
- Size:
- Date:
- A4
- Number:
- Time:
- Revision:
- Sheet
- of
- File:
- (in symbol WE-Card Connectors 693022010811) Micro SIM Card

### Library data of the parts
1 = SIM800C: GSM/GPS module
C5 = 2: Tantalum Capacitor; Manufacturer: Kemet; Manufacturer Part Number: T491A106K016AT; Manufacturer Size Code: A; Tolerance: ±10%; ESR (Equivalent Series Resistance): 7 Ohm; Type: Molded; Lifetime @ Temp.: 2000 Hrs @ 85°C; Supplier 1: Digi-Key; Supplier Part Number 1: 399-8269-1-ND; RoHS: RoHS Compliant; Category: Capacitors; Stock 1: 46669; Pricing 1: 1=0.41, 10=0.362, 50=0.2198, 100=0.181, 250=0.14476, 500=0.13184, 1000=0.11891 (USD); Packaging: Cut Tape (CT); Operating Temperature: -55°C ~ 125°C; Mounting Type: Surface Mount; Package / Case: 1206 (3216 Metric); Size / Dimension: 0.126" L x 0.063" W (3.20mm x 1.60mm); Height - Seated (Max): 0.071" (1.80mm); Lead Spacing: -; Features: General Purpose; ComponentLink1URL: http://www.kemet.com/Lists/ProductCatalog/Attachments/254/KEM_T2005_T491.pdf; ComponentLink1Description: http://www.kemet.com/Lists/ProductCatalog/Attachments/254/KEM_T2005_T491.pdf
C6 = 1: Chip Capacitor CER; Manufacturer: Kemet; Manufacturer Part Number: C0603C104K5RACTU; Tolerance: ±10%; Voltage - Rated: 50V; Temperature Coefficient: X7R; Supplier 1: Digi-Key; Supplier Part Number 1: 399-5089-1-ND; RoHS: RoHS Compliant; Category: Capacitors; Stock 1: 3992655; Pricing 1: 1=0.1, 10=0.041, 50=0.0222, 100=0.0187, 250=0.01532, 500=0.0131, 1000=0.0102 (USD); Packaging: Cut Tape (CT); Mounting Type: Surface Mount, MLCC; Operating Temperature: -55°C ~ 125°C; Applications: General Purpose; Ratings: -; Package / Case: 0603 (1608 Metric); Size / Dimension: 0.063" L x 0.031" W (1.60mm x 0.80mm); Height - Seated (Max): -; Thickness (Max): 0.034" (0.87mm); Lead Spacing: -; Features: -; Lead Style: -; ComponentLink1URL: http://www.kemet.com/docfinder?Partnumber=C0603C104K5RACTU; ComponentLink1Description: http://www.kemet.com/docfinder?Partnumber=C0603C104K5RACTU
C7 C8 C28-C30 C45-C48 = 1: as C64 on sheet [07] - SD; Supplier 1: Digi-Key; Supplier Part Number 1: 399-5089-1-ND; RoHS: RoHS Compliant; Category: Capacitors; Stock 1: 3992655; Pricing 1: 1=0.1, 10=0.041, 50=0.0222, 100=0.0187, 250=0.01532, 500=0.0131, 1000=0.0102 (USD); Packaging: Cut Tape (CT); Mounting Type: Surface Mount, MLCC; Operating Temperature: -55°C ~ 125°C; Applications: General Purpose; Ratings: -; Package / Case: 0603 (1608 Metric); Size / Dimension: 0.063" L x 0.031" W (1.60mm x 0.80mm); Height - Seated (Max): -; Thickness (Max): 0.034" (0.87mm); Lead Spacing: -; Features: -; Lead Style: -; ComponentLink1URL: http://www.kemet.com/docfinder?Partnumber=C0603C104K5RACTU; ComponentLink1Description: http://www.kemet.com/docfinder?Partnumber=C0603C104K5RACTU
D6 = 3: Led 0805; Manufacturer: Vishay Lite-On; Manufacturer Part Number: LTST-S220GKT; ID: 3; Lens Colour: Clear,Colorless; Viewing Angle: 130°; Lens Style: Clear,Diffused,Colorless,Rectangular; Luminous Intensity: 10mcd; Forward Voltage: 2.1V; Forward Current: 30mA; Power Rating: 100mW; Dominant Wavelength: 569nm; Test Current: 20mA; Lens Transparency: Clear; Number of Elements: 1; Wavelength: 565nm; Reverse Voltage: 5V; Supplier 1: Digi-Key; Supplier Part Number 1: 160-1218-6-ND; Stock 1: 87001; Pricing 1: 1=0.27, 10=0.199, 25=0.1464, 100=0.1045, 250=0.07108, 500=0.0627, 1000=0.04912 (USD); Mount: Surface Mount; Case/Package: 0805; Number of Pins: 2; Case Code (Metric): 2012; Case Code (Imperial): 0805; Min Operating Temperature: -55°C; Max Operating Temperature: 85°C; Package Quantity: 1; Packaging: Tape and Reel; Illumination Colour: Green; Power Dissipation: 100mW; Number of LEDs: 1; Length: 2.1mm; Height: 0.6mm; Width: 1mm; Depth: 0.6mm; Radiation Hardening: No; Lead Free: Lead Free; ComponentLink1URL: https://datasheet.ciiva.com/2110/ltst-s220gkt-2110016.pdf; ComponentLink1Description: https://datasheet.ciiva.com/2110/ltst-s220gkt-2110016.pdf; ComponentLink2URL: https://datasheet.ciiva.com/11775/0900766b80dc0b6e-11775442.pdf; ComponentLink2Description: https://datasheet.ciiva.com/11775/0900766b80dc0b6e-11775442.pdf; ComponentLink3URL: https://datasheet.ciiva.com/15118/getdatasheetpartid-221136-15118117.pdf; ComponentLink3Description: https://datasheet.ciiva.com/15118/getdatasheetpartid-221136-15118117.pdf; ComponentLink4URL: https://datasheet.ciiva.com/2110/ltst-s220gkt-2110017.pdf; ComponentLink4Description: https://datasheet.ciiva.com/2110/ltst-s220gkt-2110017.pdf; ComponentLink5URL: https://datasheet.ciiva.com/16444/ltst-s220gkt-16444773.pdf; ComponentLink5Description: https://datasheet.ciiva.com/16444/ltst-s220gkt-16444773.pdf
D7 = SMF05CT1G: 5-Line Transient Voltage  Suppressor Array; Manufacturer: ON Semiconductor; Type: Zener; Unidirectional Channels: 5; Voltage - Reverse Standoff (Typ): 5V (Max); Voltage - Breakdown (Min): 6.2V; Voltage - Clamping (Max) @ Ipp: 12.5V; Current - Peak Pulse (10/1000µs): 8A (8/20µs); Power - Peak Pulse: 100W; Power Line Protection: No; Capacitance @ Frequency: 80pF @ 1MHz; Supplier 1: Digi-Key; Supplier Part Number 1: SMF05CT1GOSCT-ND; Manufacturer Part Number: SMF05CT1G; RoHS: RoHS Compliant; Category: Circuit Protection; Stock 1: 13951; Pricing 1: 1=0.59, 10=0.413, 25=0.3392, 100=0.2709, 250=0.19736, 500=0.16026, 1000=0.12319 (USD); Packaging: Cut Tape (CT); Bidirectional Channels: -; Applications: General Purpose; Operating Temperature: -40°C ~ 125°C; Mounting Type: Surface Mount; Package / Case: 6-TSSOP, SC-88, SOT-363; Supplier Device Package: SC-88/SC70-6/SOT-363; ComponentLink1URL: http://www.onsemi.com/pub_link/Collateral/SMF05C-D.PDF; ComponentLink1Description: http://www.onsemi.com/pub_link/Collateral/SMF05C-D.PDF
J2 = AMPHENOL_132134: Manufacturer: TE Connectivity; Manufacturer Part Number: 5-1814832-1; Body Material: Zinc; Plating: Nickel; Body Plating: Gold; Dielectric Material: PTFE; Impedance: 50R; Frequency: 3GHz; Gender: Female; Connector Type: Jack,SMA; Polarity: Normal; Wire/Cable Type: Coaxial; Insulation Resistance: 5GR; Connector System: Cable-to-Board; Number of Positions: 1; Sealable: No (Without); Tail Length: 4mm; Family: SMA; Author: CERN DEM JLC; Supplier 1: Digi-Key; Supplier Part Number 1: A97594-ND; Stock 1: 20161; Pricing 1: 1=2.21, 10=2.121, 25=1.944, 50=1.8556, 100=1.7673, 250=1.54636, 500=1.50218, 1000=1.32545 (USD); Mount: PCB,Through Hole; Case/Package: SMA; Contact Material: Bronze; Contact Plating: Gold; Insulation Material: Polytetrafluoroethylene; Min Operating Temperature: -67°C; Max Operating Temperature: 185°C; Package Quantity: 1; Fastening Type: Threaded; Packaging: Box; Termination: Through Hole; Max Frequency: 3GHz; Orientation: Straight; Length: 0.532inch; Depth: 6.4mm; Radiation Hardening: No; REACH SVHC: No SVHC; Lead Free: Lead Free; ELV: Compliant
Q3 Q5 = n-p-n transistor
R2 R3 = 1: as R39 on sheet [04] - USB-UART; Supplier 1: Digi-Key; Supplier Part Number 1: P10KGDKR-ND; Stock 1: 10740434; Pricing 1: 1=0.1, 10=0.054, 100=0.022, 1000=0.00988, 2500=0.00858 (USD); Mount: Surface Mount; Case/Package: 0603; Weight: 7.1E-05oz; Case Code (Imperial): 0603; Case Code (Metric): 1608; Contact Plating: Tin; Min Operating Temperature: -55°C; Max Operating Temperature: 155°C; Packaging: Tape and Reel; Package Quantity: 1; Composition: Thick Film; Termination: SMD/SMT; Number of Terminations: 2; Military Standard: Not; Max Power Dissipation: 100mW; Working Voltage: 75V; Features: Automotive AEC-Q200; Length: 1.6mm; Height: 0.45mm; Width: 0.8mm; Depth: 0.8mm; REACH SVHC: No SVHC; Lead Free: Lead Free; ComponentLink1URL: https://datasheet.ciiva.com/34303/2007265-34303757.pdf; ComponentLink1Description: https://datasheet.ciiva.com/34303/2007265-34303757.pdf; ComponentLink2URL: https://datasheet.ciiva.com/11809/0900766b80f806dd-11809566.pdf; ComponentLink2Description: https://datasheet.ciiva.com/11809/0900766b80f806dd-11809566.pdf; ComponentLink3URL: https://datasheet.ciiva.com/28514/1678796-28514213.pdf; ComponentLink3Description: https://datasheet.ciiva.com/28514/1678796-28514213.pdf; ComponentLink4URL: https://datasheet.ciiva.com/30147/4aoa0000ce1-30147029.pdf; ComponentLink4Description: https://datasheet.ciiva.com/30147/4aoa0000ce1-30147029.pdf; ComponentLink5URL: https://datasheet.ciiva.com/46371/1678796-46371909.pdf; ComponentLink5Description: https://datasheet.ciiva.com/46371/1678796-46371909.pdf; ComponentLink6URL: https://datasheet.ciiva.com/24133/aoa0000ce1-37422-24133064.pdf; ComponentLink6Description: https://datasheet.ciiva.com/24133/aoa0000ce1-37422-24133064.pdf; ComponentLink7URL: https://datasheet.ciiva.com/46385/1678796-46385240.pdf; ComponentLink7Description: https://datasheet.ciiva.com/46385/1678796-46385240.pdf; ComponentLink8URL: https://datasheet.ciiva.com/17212/aoa0000ce1-17212106.pdf; ComponentLink8Description: https://datasheet.ciiva.com/17212/aoa0000ce1-17212106.pdf; ComponentLink9URL: https://datasheet.ciiva.com/9117/aoa0000ce1-9117038.pdf; ComponentLink9Description: https://datasheet.ciiva.com/9117/aoa0000ce1-9117038.pdf; ComponentLink10URL: https://datasheet.ciiva.com/16740/aoa0000ce1-16740655.pdf; ComponentLink10Description: https://datasheet.ciiva.com/16740/aoa0000ce1-16740655.pdf; ComponentLink11URL: https://datasheet.ciiva.com/48531/aoa0000ce1-48531887.pdf; ComponentLink11Description: https://datasheet.ciiva.com/48531/aoa0000ce1-48531887.pdf
R12 R13 R28-R30 = 1: Chip Resistor; Manufacturer: Panasonic; Manufacturer Part Number: ERJ-3EKF3300V; Tolerance: 1%; Power Rating: 100mW; Voltage Rating (DC): 75V; Temperature Coefficient: 100ppm/°C; ComponentLink1URL: http://industrial.panasonic.com/www-cgi/jvcr13pz.cgi?E+PZ+3+AOA0002+ERJ6ENF3000V+7+WW; ComponentLink1Description: http://industrial.panasonic.com/www-cgi/jvcr13pz.cgi?E+PZ+3+AOA0002+ERJ6ENF3000V+7+WW; Supplier 1: Digi-Key; Supplier Part Number 1: P330HDKR-ND; Stock 1: 924496; Pricing 1: 1=0.1, 10=0.079, 100=0.0323, 1000=0.01449, 2500=0.01258 (USD); Mount: Surface Mount; Case/Package: 0603; Number of Pins: 2; Weight: 7.1E-05oz; Case Code (Imperial): 0603; Case Code (Metric): 1608; Contact Plating: Tin; Min Operating Temperature: -55°C; Max Operating Temperature: 155°C; Packaging: Tape and Reel; Voltage Rating: 75V; Package Quantity: 1; Composition: Thick Film; Termination: SMD/SMT; Number of Terminations: 2; Military Standard: Not; Max Power Dissipation: 100mW; Features: Automotive AEC-Q200; Length: 1.6mm; Height: 0.022inch; Width: 0.8mm; Depth: 0.8mm; Radiation Hardening: No; REACH SVHC: No SVHC; Lead Free: Lead Free; ComponentLink2URL: https://datasheet.ciiva.com/7886/aoa0000ce2-7886729.pdf; ComponentLink2Description: https://datasheet.ciiva.com/7886/aoa0000ce2-7886729.pdf; ComponentLink3URL: https://datasheet.ciiva.com/48531/aoa0000ce2-48531001.pdf; ComponentLink3Description: https://datasheet.ciiva.com/48531/aoa0000ce2-48531001.pdf; ComponentLink4URL: https://datasheet.ciiva.com/22721/426256-22721099.pdf; ComponentLink4Description: https://datasheet.ciiva.com/22721/426256-22721099.pdf; ComponentLink5URL: https://datasheet.ciiva.com/46373/1678782-46373899.pdf; ComponentLink5Description: https://datasheet.ciiva.com/46373/1678782-46373899.pdf; ComponentLink6URL: https://datasheet.ciiva.com/9117/aoa0000ce2-9117132.pdf; ComponentLink6Description: https://datasheet.ciiva.com/9117/aoa0000ce2-9117132.pdf; ComponentLink7URL: https://datasheet.ciiva.com/46373/1678782-46373900.pdf; ComponentLink7Description: https://datasheet.ciiva.com/46373/1678782-46373900.pdf
R16 R17 = 1: Chip Resistor; Manufacturer: Panasonic; Manufacturer Part Number: ERJ-3GEY0R00V; Power Rating: 100mW; Voltage Rating: 75V; Tolerance: 0%; Temperature Coefficient: 600ppm/°C; Voltage Rating (DC): 50V; Supplier 1: Digi-Key; Supplier Part Number 1: P0.0GDKR-ND; Stock 1: 19868266; Pricing 1: 1=0.1, 10=0.053, 25=0.038, 50=0.029, 100=0.0214, 250=0.01632, 500=0.01306, 1000=0.00962 (USD); Mount: Surface Mount; Case/Package: 0603; Case Code (Metric): 1608; Case Code (Imperial): 0603; Contact Plating: Tin; Min Operating Temperature: -55°C; Max Operating Temperature: 155°C; Packaging: Tape and Reel; Package Quantity: 1; Composition: Thick Film; Number of Terminations: 2; Termination: SMD/SMT; Military Standard: Not; Max Power Dissipation: 100mW; Features: Automotive AEC-Q200; Length: 1.6mm; Height: 0.45mm; Width: 0.031inch; Depth: 0.8mm; Radiation Hardening: No; REACH SVHC: No SVHC; Lead Free: Lead Free; ComponentLink1URL: https://datasheet.ciiva.com/27055/1935748-27055113.pdf; ComponentLink1Description: https://datasheet.ciiva.com/27055/1935748-27055113.pdf; ComponentLink2URL: https://datasheet.ciiva.com/11808/0900766b80f806dd-11808207.pdf; ComponentLink2Description: https://datasheet.ciiva.com/11808/0900766b80f806dd-11808207.pdf; ComponentLink3URL: https://datasheet.ciiva.com/48532/aoa0000ce1-48532165.pdf; ComponentLink3Description: https://datasheet.ciiva.com/48532/aoa0000ce1-48532165.pdf; ComponentLink4URL: https://datasheet.ciiva.com/43460/1678796-43460647.pdf; ComponentLink4Description: https://datasheet.ciiva.com/43460/1678796-43460647.pdf; ComponentLink5URL: https://datasheet.ciiva.com/28695/1678796-28695833.pdf; ComponentLink5Description: https://datasheet.ciiva.com/28695/1678796-28695833.pdf; ComponentLink6URL: https://datasheet.ciiva.com/5959/1678796-5959707.pdf; ComponentLink6Description: https://datasheet.ciiva.com/5959/1678796-5959707.pdf; ComponentLink7URL: https://datasheet.ciiva.com/16834/aoa0000ce1-16834828.pdf; ComponentLink7Description: https://datasheet.ciiva.com/16834/aoa0000ce1-16834828.pdf; ComponentLink8URL: https://datasheet.ciiva.com/17215/aoa0000ce1-17215388.pdf; ComponentLink8Description: https://datasheet.ciiva.com/17215/aoa0000ce1-17215388.pdf; ComponentLink9URL: https://datasheet.ciiva.com/46377/1678796-46377868.pdf; ComponentLink9Description: https://datasheet.ciiva.com/46377/1678796-46377868.pdf; ComponentLink10URL: https://datasheet.ciiva.com/30199/4aoa0000ce1-30199822.pdf; ComponentLink10Description: https://datasheet.ciiva.com/30199/4aoa0000ce1-30199822.pdf; ComponentLink11URL: https://datasheet.ciiva.com/9198/aoa0000ce1-9198975.pdf; ComponentLink11Description: https://datasheet.ciiva.com/9198/aoa0000ce1-9198975.pdf; ComponentLink12URL: https://datasheet.ciiva.com/16758/70255313-16758527.pdf; ComponentLink12Description: https://datasheet.ciiva.com/16758/70255313-16758527.pdf
TVS2 = TVS-LXE15AAA1-153
XS1 = WE-Card Connectors 693022010811: WR-CRD Micro SIM_Hinge_8 pins; Manufacturer: Würth Elektronik eiSos GmbH; ComponentLink1 Description: Manufacturer; ComponentLink2 Description: Datasheet; NoPins: 8; ComponentLink1URL: http://www.we-online.de; ComponentLink2URL: http://katalog.we-online.de/em/datasheet/693022010811.pdf; Created by: Karrer Zheng; Created Date: 10/20/2014; partNo: 693022010811

## Sheet [05] - Sensors.SchDoc
size A4
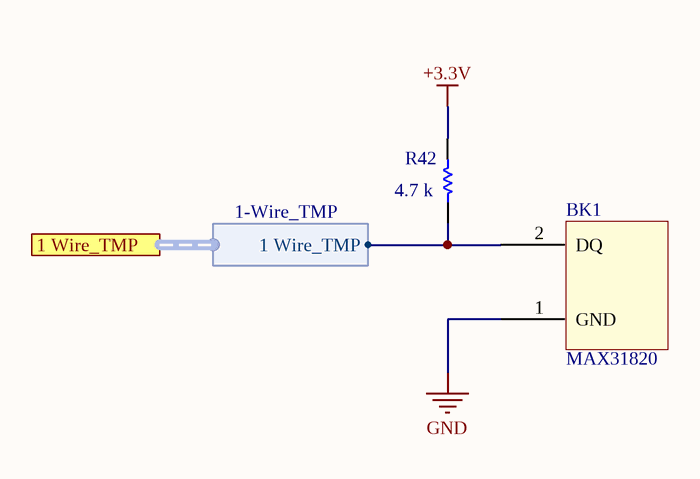
[diagram p10: [05] - Sensors.SchDoc]

### Parts
BK1  MAX31820
R42  Resistance: 4.7 k  [Res-0603]  (hidden comment: Res1)

### Ports
1 Wire_TMP (harness 1-Wire_TMP)

### Harnesses
1-Wire_TMP: 1 Wire_TMP

### Nets
+3.3V: R42.2
GND: BK1.1(GND)
1 Wire_TMP: BK1.2(DQ) R42.1 ; port 1 Wire_TMP.1 Wire_TMP

### Notes on the sheet
- Title
- Size:
- Date:
- A4
- Number:
- Time:
- Revision:
- Sheet
- of
- File:

### Library data of the parts
BK1 = MAX31820: MAX31820PAR  temper sensor
R42 = 1: as R39 on sheet [04] - USB-UART; Supplier 1: Digi-Key; Supplier Part Number 1: P10KGDKR-ND; Stock 1: 10740434; Pricing 1: 1=0.1, 10=0.054, 100=0.022, 1000=0.00988, 2500=0.00858 (USD); Mount: Surface Mount; Case/Package: 0603; Weight: 7.1E-05oz; Case Code (Imperial): 0603; Case Code (Metric): 1608; Contact Plating: Tin; Min Operating Temperature: -55°C; Max Operating Temperature: 155°C; Packaging: Tape and Reel; Package Quantity: 1; Composition: Thick Film; Termination: SMD/SMT; Number of Terminations: 2; Military Standard: Not; Max Power Dissipation: 100mW; Working Voltage: 75V; Features: Automotive AEC-Q200; Length: 1.6mm; Height: 0.45mm; Width: 0.8mm; Depth: 0.8mm; REACH SVHC: No SVHC; Lead Free: Lead Free; ComponentLink1URL: https://datasheet.ciiva.com/34303/2007265-34303757.pdf; ComponentLink1Description: https://datasheet.ciiva.com/34303/2007265-34303757.pdf; ComponentLink2URL: https://datasheet.ciiva.com/11809/0900766b80f806dd-11809566.pdf; ComponentLink2Description: https://datasheet.ciiva.com/11809/0900766b80f806dd-11809566.pdf; ComponentLink3URL: https://datasheet.ciiva.com/28514/1678796-28514213.pdf; ComponentLink3Description: https://datasheet.ciiva.com/28514/1678796-28514213.pdf; ComponentLink4URL: https://datasheet.ciiva.com/30147/4aoa0000ce1-30147029.pdf; ComponentLink4Description: https://datasheet.ciiva.com/30147/4aoa0000ce1-30147029.pdf; ComponentLink5URL: https://datasheet.ciiva.com/46371/1678796-46371909.pdf; ComponentLink5Description: https://datasheet.ciiva.com/46371/1678796-46371909.pdf; ComponentLink6URL: https://datasheet.ciiva.com/24133/aoa0000ce1-37422-24133064.pdf; ComponentLink6Description: https://datasheet.ciiva.com/24133/aoa0000ce1-37422-24133064.pdf; ComponentLink7URL: https://datasheet.ciiva.com/46385/1678796-46385240.pdf; ComponentLink7Description: https://datasheet.ciiva.com/46385/1678796-46385240.pdf; ComponentLink8URL: https://datasheet.ciiva.com/17212/aoa0000ce1-17212106.pdf; ComponentLink8Description: https://datasheet.ciiva.com/17212/aoa0000ce1-17212106.pdf; ComponentLink9URL: https://datasheet.ciiva.com/9117/aoa0000ce1-9117038.pdf; ComponentLink9Description: https://datasheet.ciiva.com/9117/aoa0000ce1-9117038.pdf; ComponentLink10URL: https://datasheet.ciiva.com/16740/aoa0000ce1-16740655.pdf; ComponentLink10Description: https://datasheet.ciiva.com/16740/aoa0000ce1-16740655.pdf; ComponentLink11URL: https://datasheet.ciiva.com/48531/aoa0000ce1-48531887.pdf; ComponentLink11Description: https://datasheet.ciiva.com/48531/aoa0000ce1-48531887.pdf